# EasyEDA schematic Robot_Led_Stripe_1.25mm.json
TITLE: 4 in a row robot V0.V Aug 2025; REV: 0.0; Date: 2025-08-03; Sheet: 1/1; Drawn By: AmirB; Company: Your Company
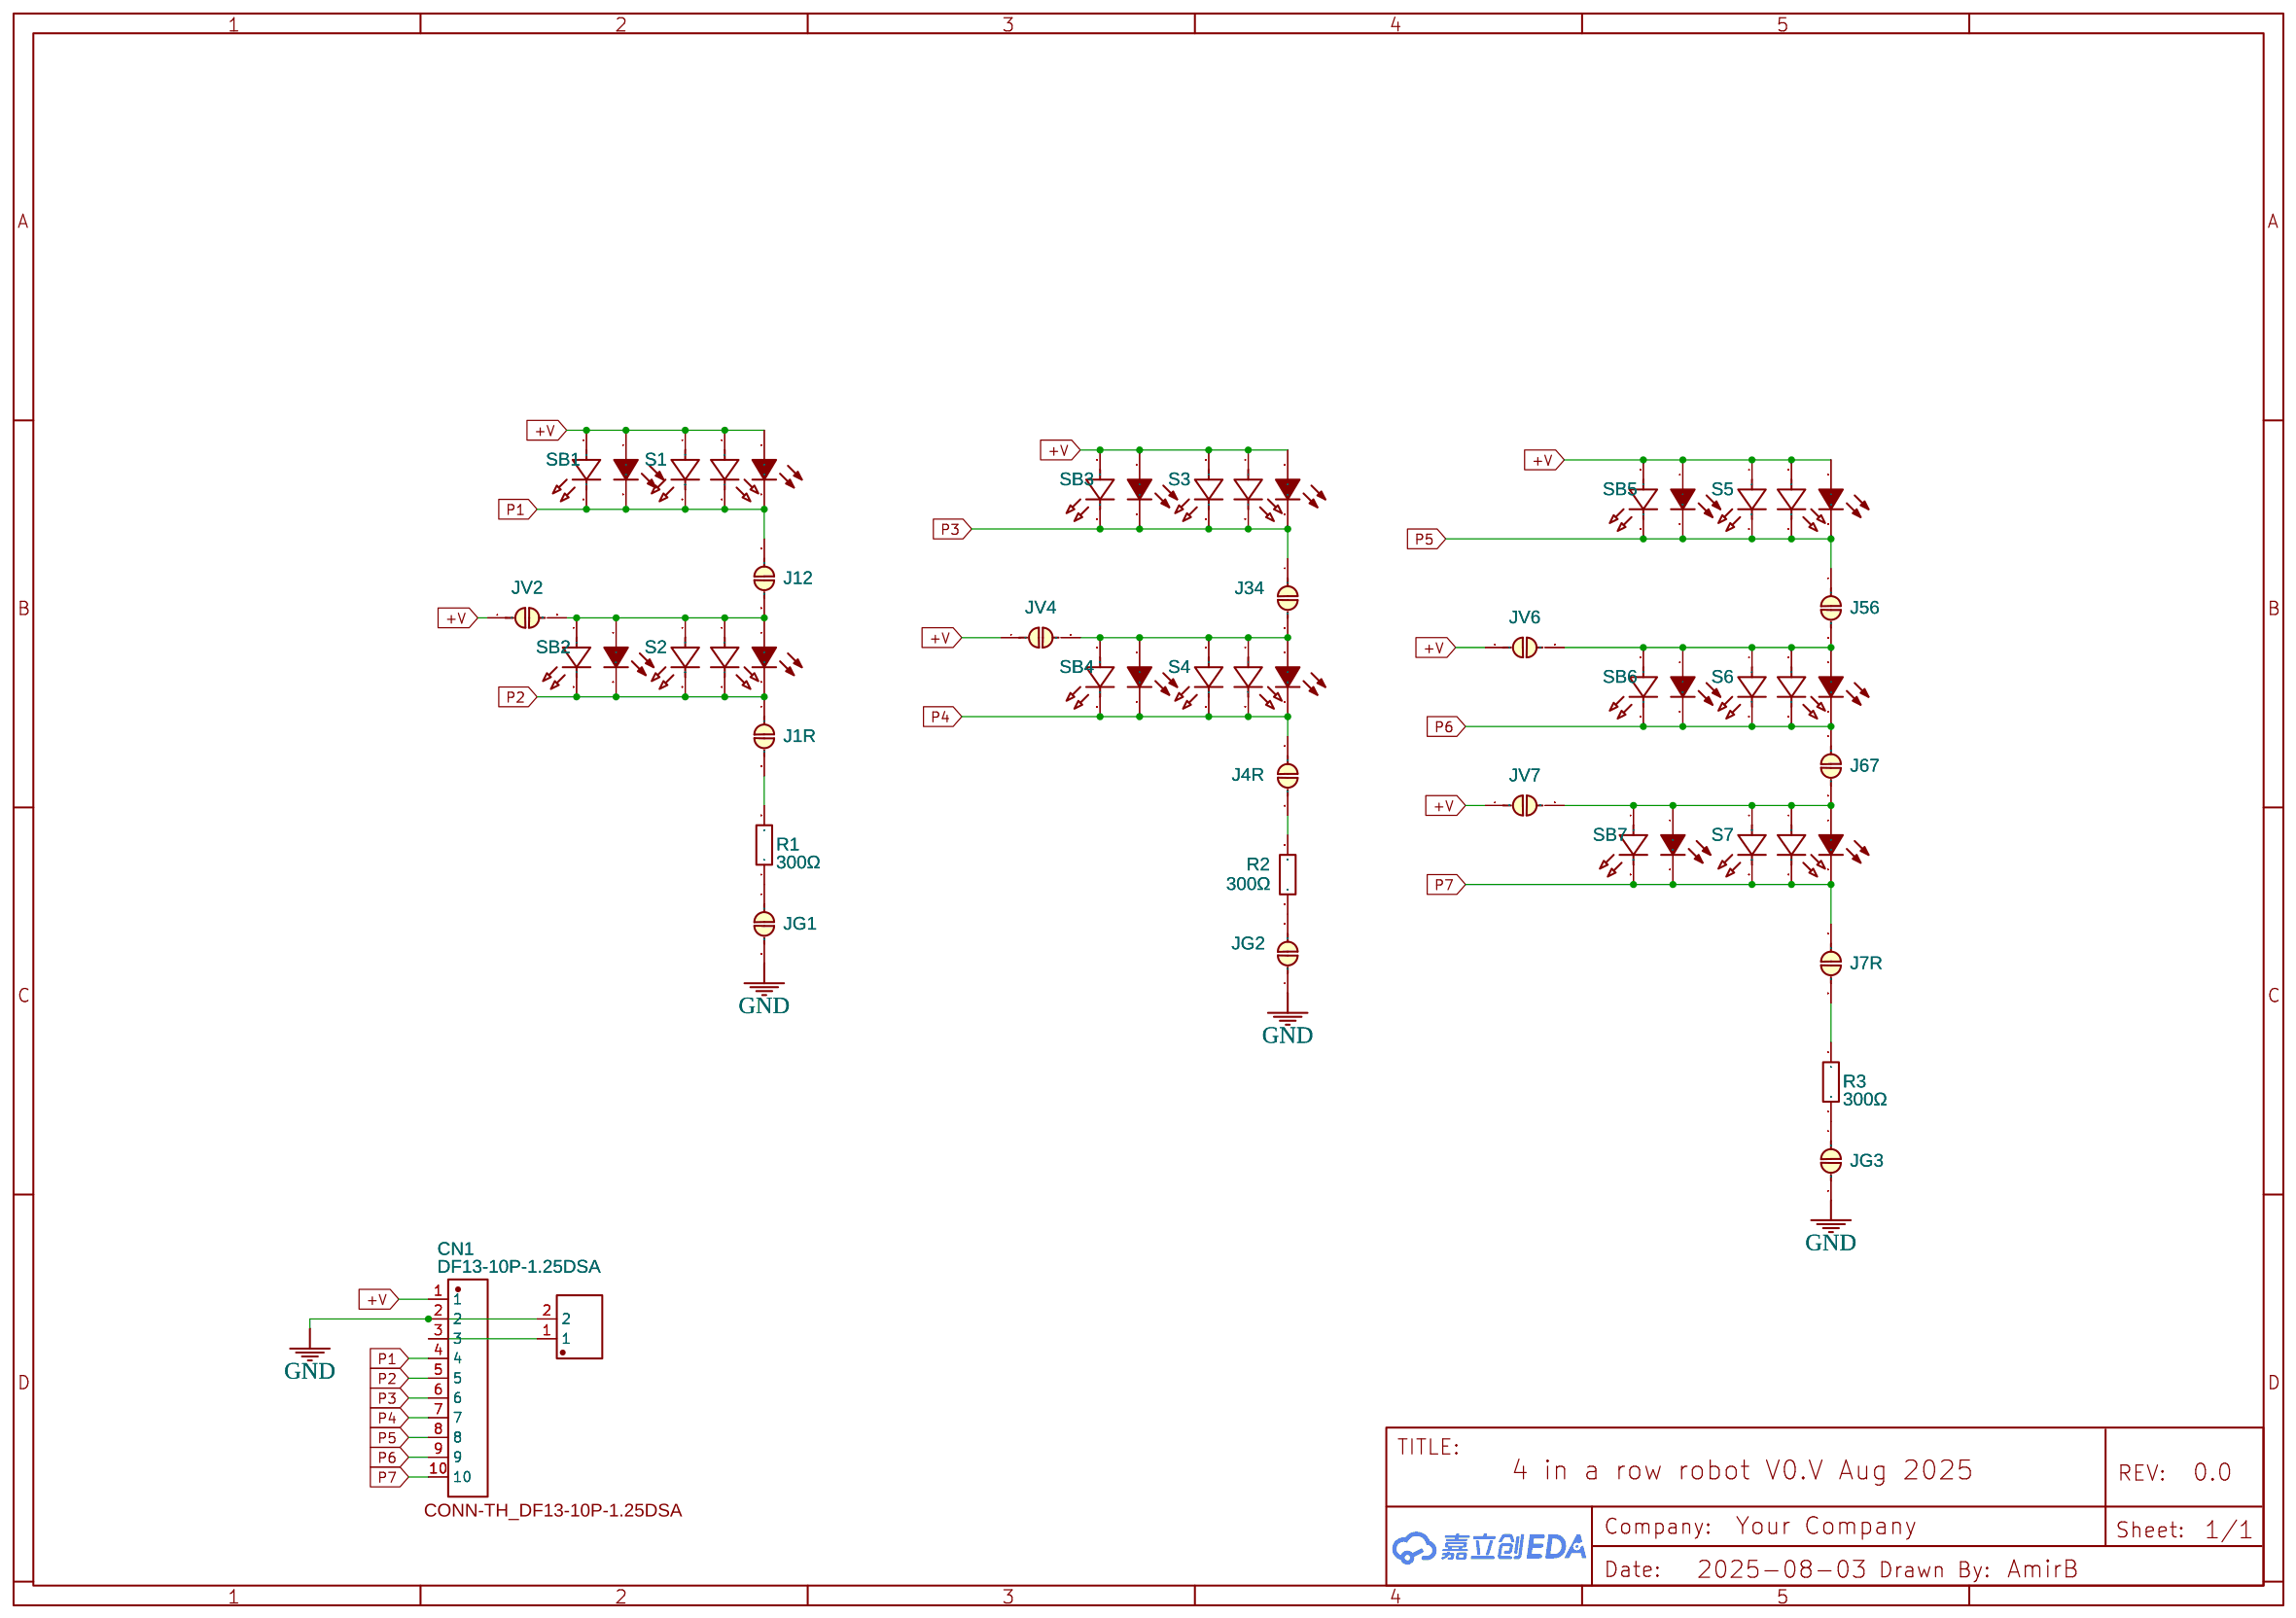
[diagram p0: schematic sheet]

## Parts
CN1  DF13-10P-1.25DSA  [CONN-TH_DF13-10P-1.25DSA]
ECON1  KF2510-2A  [CONN-TH_KF2510-2A]
J1R  J1R  [JUMPERS_SMT-JUMPER_2_NC_PASTE_NO-SILK]
J4R  J4R  [JUMPERS_SMT-JUMPER_2_NC_PASTE_NO-SILK]
J7R  J7R  [JUMPERS_SMT-JUMPER_2_NC_PASTE_NO-SILK]
J12  J1  [JUMPERS_SMT-JUMPER_2_NC_PASTE_NO-SILK]
J34  J34  [JUMPERS_SMT-JUMPER_2_NC_PASTE_NO-SILK]
J56  J56  [JUMPERS_SMT-JUMPER_2_NC_PASTE_NO-SILK]
J67  J67  [JUMPERS_SMT-JUMPER_2_NC_PASTE_NO-SILK]
JG1  JG3  [JUMPERS_SMT-JUMPER_2_NC_PASTE_NO-SILK]
JG2  JG3  [JUMPERS_SMT-JUMPER_2_NC_PASTE_NO-SILK]
JG3  JG3  [JUMPERS_SMT-JUMPER_2_NC_PASTE_NO-SILK]
JV2  JV1  [JUMPERS_SMT-JUMPER_2_NC_PASTE_NO-SILK]
JV4  JV1  [JUMPERS_SMT-JUMPER_2_NC_PASTE_NO-SILK]
JV6  JV1  [JUMPERS_SMT-JUMPER_2_NC_PASTE_NO-SILK]
JV7  JV1  [JUMPERS_SMT-JUMPER_2_NC_PASTE_NO-SILK]
L1  LED  [LED0603-R-RD_BLUE]
L2  LED  [LED0603-R-RD_BLUE]
L3  LED  [LED0603-R-RD_BLUE]
L4  LED  [LED0603-R-RD_BLUE]
L5  LED  [LED0603-R-RD_BLUE]
L6  LED  [LED0603-R-RD_BLUE]
L7  LED  [LED0603-R-RD_BLUE]
LB1  LED  [LED0603-R-RD_BLUE]
LB2  LED  [LED0603-R-RD_BLUE]
LB3  LED  [LED0603-R-RD_BLUE]
LB4  LED  [LED0603-R-RD_BLUE]
LB5  LED  [LED0603-R-RD_BLUE]
LB6  LED  [LED0603-R-RD_BLUE]
LB7  LED  [LED0603-R-RD_BLUE]
R1  300Ω  [R0603]
R2  300Ω  [R0603]
R3  300Ω  [R0603]
S1  XYC-PT3528AC-IC  [SENSOR-SMD_L3.2-W2.8-LS3.5_XYC-PT3528AC-IC]
S2  XYC-PT3528AC-IC  [SENSOR-SMD_L3.2-W2.8-LS3.5_XYC-PT3528AC-IC]
S3  XYC-PT3528AC-IC  [SENSOR-SMD_L3.2-W2.8-LS3.5_XYC-PT3528AC-IC]
S4  XYC-PT3528AC-IC  [SENSOR-SMD_L3.2-W2.8-LS3.5_XYC-PT3528AC-IC]
S5  XYC-PT3528AC-IC  [SENSOR-SMD_L3.2-W2.8-LS3.5_XYC-PT3528AC-IC]
S6  XYC-PT3528AC-IC  [SENSOR-SMD_L3.2-W2.8-LS3.5_XYC-PT3528AC-IC]
S7  XYC-PT3528AC-IC  [SENSOR-SMD_L3.2-W2.8-LS3.5_XYC-PT3528AC-IC]
SB1  XYC-PT3528AC-IC  [SENSOR-SMD_L3.2-W2.8-LS3.5_XYC-PT3528AC-IC]
SB2  XYC-PT3528AC-IC  [SENSOR-SMD_L3.2-W2.8-LS3.5_XYC-PT3528AC-IC]
SB3  XYC-PT3528AC-IC  [SENSOR-SMD_L3.2-W2.8-LS3.5_XYC-PT3528AC-IC]
SB4  XYC-PT3528AC-IC  [SENSOR-SMD_L3.2-W2.8-LS3.5_XYC-PT3528AC-IC]
SB5  XYC-PT3528AC-IC  [SENSOR-SMD_L3.2-W2.8-LS3.5_XYC-PT3528AC-IC]
SB6  XYC-PT3528AC-IC  [SENSOR-SMD_L3.2-W2.8-LS3.5_XYC-PT3528AC-IC]
SB7  XYC-PT3528AC-IC  [SENSOR-SMD_L3.2-W2.8-LS3.5_XYC-PT3528AC-IC]
U1  L240CTZ0G3MM  [LED-TH_BD3.8-P2.54_L240CTZ0G3MM]
U2  L240CTZ0G3MM  [LED-TH_BD3.8-P2.54_L240CTZ0G3MM]
U3  L240CTZ0G3MM  [LED-TH_BD3.8-P2.54_L240CTZ0G3MM]
U4  L240CTZ0G3MM  [LED-TH_BD3.8-P2.54_L240CTZ0G3MM]
U5  L240CTZ0G3MM  [LED-TH_BD3.8-P2.54_L240CTZ0G3MM]
U6  L240CTZ0G3MM  [LED-TH_BD3.8-P2.54_L240CTZ0G3MM]
U7  L240CTZ0G3MM  [LED-TH_BD3.8-P2.54_L240CTZ0G3MM]

## Library data of the parts
CN1 = DF13-10P-1.25DSA: Contributor: LCSC; Supplier: LCSC; Supplier Part: C531028; Manufacturer: HRS(广濑); JLCPCB Part Class: Extended Part; Package Display: Yes
ECON1 = KF2510-2A: Supplier: LCSC; Manufacturer: BOOMELE; Supplier Part: C27543; JLCPCB Part Class: Extended Part; Package Display: No
J1R J4R J7R J12 J34 J56 J67 JG1-JG3 JV2 JV4 JV6 JV7 = JUMPER-SMT_2: Contributor: P-Thomsen; Package Display: No
L1-L7 LB1-LB7 = 19-217/BHC-ZL1M2RY/3T: Supplier: LCSC; Manufacturer: EVERLIGHT; Supplier Part: C72041; JLCPCB Part Class: Basic Part; Package Display: No
R1-R3 = 0603WAF3000T5E: Supplier: LCSC; Manufacturer: UNI-ROYAL(厚声); Supplier Part: C23025; JLCPCB Part Class: Basic Part; Package Display: No
S1-S7 SB1-SB7 = XYC-PT3528AC-IC: Contributor: lcsc; Supplier: LCSC; Supplier Part: C6081269; Manufacturer: NEWOPTO(鑫永诚光电); JLCPCB Part Class: Extended Part; Package Display: No
U1-U7 = L240CTZ0G3MM: Supplier: LCSC; Supplier Part: C9900093286; Manufacturer: null; Contributor: lcsc; JLCPCB Part Class: Extended Part; Package Display: No

## Nets
GND: CN1.2 ECON1.2 JG1.2 JG2.2 JG3.2
+V: CN1.1 JV2.1 JV4.1 JV6.1 JV7.1 L1.1(A) L3.1(A) L5.1(A) LB1.1(A) LB3.1(A) LB5.1(A) S1.1 S3.1 S5.1 SB1.1 SB3.1 SB5.1 U1.1(A) U3.1(A) U5.1(A)
P1: CN1.4 J12.1 L1.2(C) LB1.2(C) S1.2 SB1.2 U1.2(K)
P2: CN1.5 J1R.1 L2.2(C) LB2.2(C) S2.2 SB2.2 U2.2(K)
P3: CN1.6 J34.1 L3.2(C) LB3.2(C) S3.2 SB3.2 U3.2(K)
P4: CN1.7 J4R.1 L4.2(C) LB4.2(C) S4.2 SB4.2 U4.2(K)
P5: CN1.8 J56.1 L5.2(C) LB5.2(C) S5.2 SB5.2 U5.2(K)
P6: CN1.9 J67.1 L6.2(C) LB6.2(C) S6.2 SB6.2 U6.2(K)
P7: CN1.10 J7R.1 L7.2(C) LB7.2(C) S7.2 SB7.2 U7.2(K)
Net-(CN1-3): CN1.3 ECON1.1
Net-(J1R-2): J1R.2 R1.2
Net-(J4R-2): J4R.2 R2.2
Net-(J7R-2): J7R.2 R3.2
Net-(J12-2): J12.2 JV2.2 L2.1(A) LB2.1(A) S2.1 SB2.1 U2.1(A)
Net-(J34-2): J34.2 JV4.2 L4.1(A) LB4.1(A) S4.1 SB4.1 U4.1(A)
Net-(J56-2): J56.2 JV6.2 L6.1(A) LB6.1(A) S6.1 SB6.1 U6.1(A)
Net-(J67-2): J67.2 JV7.2 L7.1(A) LB7.1(A) S7.1 SB7.1 U7.1(A)
Net-(JG1-1): JG1.1 R1.1
Net-(JG2-1): JG2.1 R2.1
Net-(JG3-1): JG3.1 R3.1
